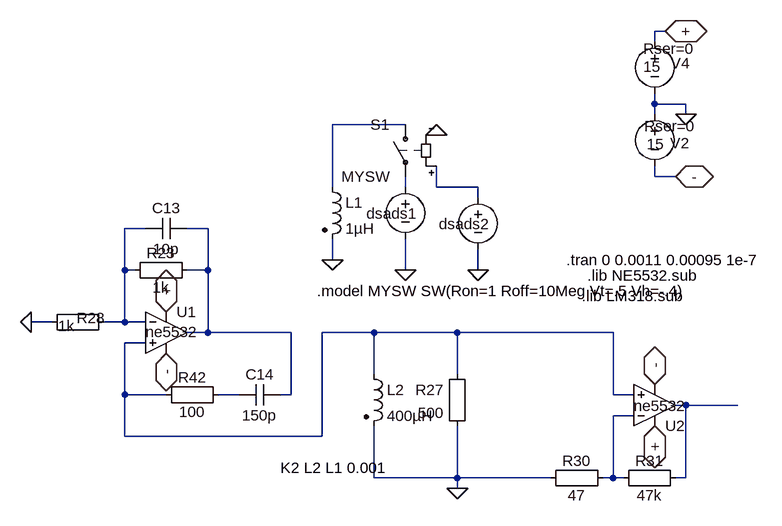
[diagram p0: schematic nehative_capcaitance_BS_5.asc]
nehative_capcaitance_BS_5.asc, the LTspice schematic file:
Version 4
SHEET 1 6068 1612
WIRE 2176 -2384 2160 -2384
WIRE 2160 -2368 2160 -2384
WIRE 2160 -2272 2160 -2288
WIRE 2208 -2272 2160 -2272
WIRE 2160 -2256 2160 -2272
WIRE 2208 -2256 2208 -2272
WIRE 1776 -2240 1664 -2240
WIRE 2160 -2160 2160 -2176
WIRE 2192 -2160 2160 -2160
WIRE 1664 -2144 1664 -2240
WIRE 1776 -2144 1776 -2160
WIRE 1824 -2144 1824 -2176
WIRE 1888 -2144 1824 -2144
WIRE 1888 -2128 1888 -2144
WIRE 1376 -2080 1344 -2080
WIRE 1472 -2080 1440 -2080
WIRE 1664 -2032 1664 -2064
WIRE 1344 -2016 1344 -2080
WIRE 1360 -2016 1344 -2016
WIRE 1472 -2016 1472 -2080
WIRE 1472 -2016 1440 -2016
WIRE 1776 -2016 1776 -2064
WIRE 1888 -2016 1888 -2048
WIRE 1232 -1936 1200 -1936
WIRE 1344 -1936 1344 -2016
WIRE 1344 -1936 1312 -1936
WIRE 1376 -1936 1344 -1936
WIRE 1472 -1920 1472 -2016
WIRE 1472 -1920 1440 -1920
WIRE 1600 -1920 1472 -1920
WIRE 1728 -1920 1648 -1920
WIRE 1856 -1920 1728 -1920
WIRE 2096 -1920 1856 -1920
WIRE 1376 -1904 1344 -1904
WIRE 1728 -1856 1728 -1920
WIRE 1856 -1856 1856 -1920
WIRE 1344 -1824 1344 -1904
WIRE 1408 -1824 1344 -1824
WIRE 1520 -1824 1488 -1824
WIRE 1600 -1824 1600 -1920
WIRE 1600 -1824 1584 -1824
WIRE 2096 -1824 2096 -1920
WIRE 2128 -1824 2096 -1824
WIRE 2208 -1808 2192 -1808
WIRE 2288 -1808 2208 -1808
WIRE 2128 -1792 2096 -1792
WIRE 1344 -1760 1344 -1824
WIRE 1648 -1760 1648 -1920
WIRE 1648 -1760 1344 -1760
WIRE 1728 -1696 1728 -1776
WIRE 1856 -1696 1856 -1776
WIRE 1856 -1696 1728 -1696
WIRE 2000 -1696 1856 -1696
WIRE 2096 -1696 2096 -1792
WIRE 2096 -1696 2080 -1696
WIRE 2112 -1696 2096 -1696
WIRE 2208 -1696 2208 -1808
WIRE 2208 -1696 2192 -1696
WIRE 1856 -1680 1856 -1696
FLAG 2192 -2160 -
IOPIN 2192 -2160 BiDir
FLAG 2176 -2384 +
IOPIN 2176 -2384 BiDir
FLAG 2208 -2256 0
FLAG 2160 -1776 +
IOPIN 2160 -1776 BiDir
FLAG 2160 -1840 -
IOPIN 2160 -1840 BiDir
FLAG 1408 -1952 +
IOPIN 1408 -1952 BiDir
FLAG 1408 -1888 -
IOPIN 1408 -1888 BiDir
FLAG 1200 -1936 0
FLAG 1856 -1680 0
FLAG 1776 -2016 0
FLAG 1888 -2016 0
FLAG 1664 -2032 0
FLAG 1824 -2224 0
SYMBOL voltage 2160 -2272 M0
WINDOW 123 0 0 Left 2
WINDOW 39 -63 34 Left 2
WINDOW 0 -53 60 Left 2
WINDOW 3 -15 62 Left 2
SYMATTR SpiceLine Rser=0
SYMATTR InstName V2
SYMATTR Value 15
SYMBOL voltage 2160 -2384 M0
WINDOW 123 0 0 Left 2
WINDOW 39 -61 27 Left 2
WINDOW 0 -54 49 Left 2
WINDOW 3 -9 55 Left 2
SYMATTR SpiceLine Rser=0
SYMATTR InstName V4
SYMATTR Value 15
SYMBOL Misc\\EuropeanResistor 1872 -1872 M0
SYMATTR InstName R27
SYMATTR Value 500
SYMBOL Opamps\\opamp2 2160 -1744 M180
WINDOW 3 -32 63 Left 2
SYMATTR Value ne5532
SYMATTR InstName U2
SYMBOL Misc\\EuropeanResistor 1984 -1680 R270
WINDOW 0 27 56 VTop 2
WINDOW 3 5 56 VBottom 2
SYMATTR InstName R30
SYMATTR Value 47
SYMBOL Misc\\EuropeanResistor 2096 -1680 R270
WINDOW 0 27 56 VTop 2
WINDOW 3 5 56 VBottom 2
SYMATTR InstName R31
SYMATTR Value 47k
SYMBOL ind2 1712 -1872 R0
SYMATTR InstName L2
SYMATTR Value 400µH
SYMATTR SpiceLine Rser=.4 Cpar=220p
SYMATTR Type ind
SYMBOL Opamps\\opamp2 1408 -1984 R0
WINDOW 3 -32 63 Left 2
SYMATTR Value ne5532
SYMATTR InstName U1
SYMBOL Misc\\EuropeanResistor 1344 -2032 M90
WINDOW 0 5 56 VBottom 2
WINDOW 3 27 56 VTop 2
SYMATTR InstName R23
SYMATTR Value 1k
SYMBOL Misc\\EuropeanCap 1440 -2064 M270
WINDOW 0 32 32 VTop 2
WINDOW 3 0 32 VBottom 2
SYMATTR InstName C13
SYMATTR Value 10p
SYMATTR SpiceLine V=400 Irms=1 Rser=.32 Lser=0
SYMBOL Misc\\EuropeanResistor 1216 -1952 M90
WINDOW 0 25 76 VBottom 2
WINDOW 3 6 38 VTop 2
SYMATTR InstName R28
SYMATTR Value 1k
SYMBOL Misc\\EuropeanCap 1584 -1808 M270
WINDOW 0 32 32 VTop 2
WINDOW 3 0 32 VBottom 2
SYMATTR InstName C14
SYMATTR Value 150p
SYMATTR SpiceLine V=400 Irms=1 Rser=.32 Lser=0
SYMBOL Misc\\EuropeanResistor 1392 -1840 M90
WINDOW 0 5 56 VBottom 2
WINDOW 3 27 56 VTop 2
SYMATTR InstName R42
SYMATTR Value 100
SYMBOL ind2 1648 -2160 R0
SYMATTR InstName L1
SYMATTR Value 1µH
SYMATTR SpiceLine Rser=.1 Rpar=1 Cpar=1p
SYMATTR Type ind
SYMBOL voltage 1776 -2160 M0
WINDOW 0 -18 57 Left 2
WINDOW 3 -134 119 Invisible 2
WINDOW 123 0 0 Left 2
SYMATTR InstName dsads1
SYMATTR Value .01
SYMATTR SpiceLine Rser=0
SYMBOL sw 1776 -2256 M0
SYMATTR InstName S1
SYMATTR Value MYSW
SYMBOL voltage 1888 -2144 M0
WINDOW 0 -18 57 Left 2
WINDOW 3 -134 119 Invisible 2
WINDOW 123 0 0 Left 2
SYMATTR InstName dsads2
SYMATTR Value PULSE(0 10 0 1e-10 1e-10 .000001 .001 1000)
TEXT 2024 -2032 Left 2 !.tran 0 0.0011 0.00095 1e-7
TEXT 2056 -2008 Left 2 !.lib NE5532.sub
TEXT 2048 -1976 Left 2 !.lib LM318.sub
TEXT 1640 -1984 Left 2 !.model MYSW SW(Ron=1 Roff=10Meg Vt=.5 Vh=-.4)
TEXT 1584 -1712 Left 2 !K2 L2 L1 0.001

The netlist it stands for:
* nehative_capcaitance_BS_5.asc
V2 0 - 15 Rser=0
V4 + 0 15 Rser=0
R27 N006 0 500
XU2 N006 N009 + - N008 ne5532  ; pins In+ In- V+ V- OUT
R30 0 N009 47
R31 N009 N008 47k
L2 N006 0 400µH Rser=.4 Cpar=220p
XU1 N006 N004 + - N005 ne5532  ; pins In+ In- V+ V- OUT
R23 N004 N005 1k
C13 N005 N004 10p V=400 Irms=1 Rser=.32 Lser=0
R28 0 N004 1k
C14 N005 N007 150p V=400 Irms=1 Rser=.32 Lser=0
R42 N006 N007 100
L1 N001 0 1µH Rser=.1 Rpar=1 Cpar=1p
V§dsads1 N002 0 .01 Rser=0
S1 N001 N002 N003 0 MYSW
V§dsads2 N003 0 PULSE(0 10 0 1e-10 1e-10 .000001 .001 1000)
.tran 0 0.0011 0.00095 1e-7
.lib NE5532.sub
.lib LM318.sub
.model MYSW SW(Ron=1 Roff=10Meg Vt=.5 Vh=-.4)
K2 L2 L1 0.001
.backanno
.end